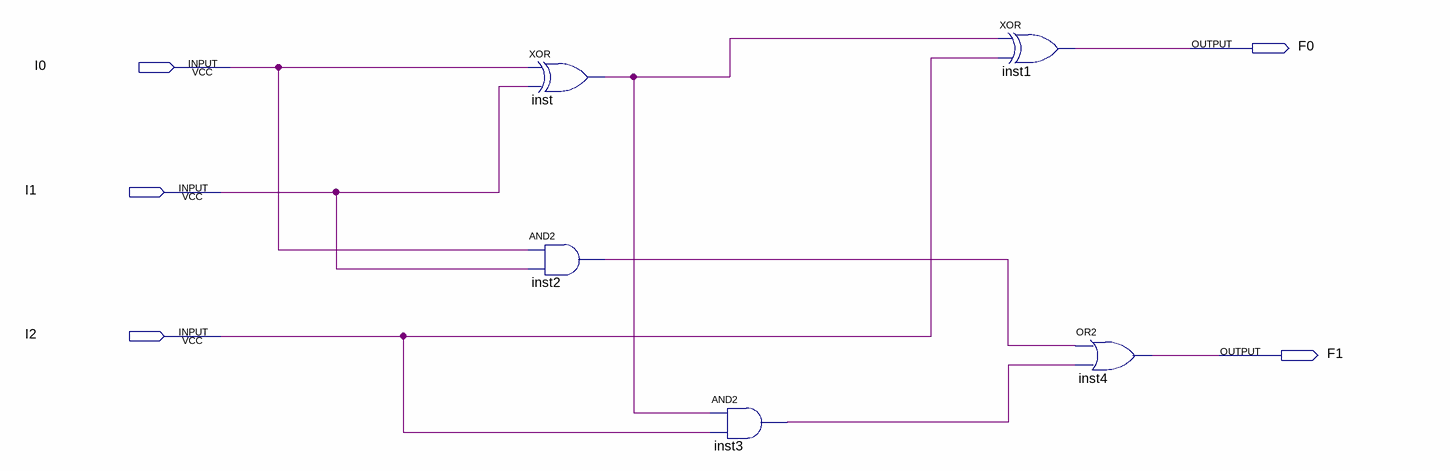
[diagram p0: schematic sheet]
// Quartus schematic FA.bdf as structural Verilog: 5 symbols, 5 pins
module FA (
  input  I0,
  input  I1,
  input  I2,
  output F0,
  output F1
);

  wire inst2_out, inst3_out, inst_out;

  xor inst (inst_out, I0, I1);
  and inst2 (inst2_out, I0, I1);
  and inst3 (inst3_out, inst_out, I2);
  xor inst1 (F0, inst_out, I2);
  or inst4 (F1, inst2_out, inst3_out);
endmodule
